# EAGLE design LEDdisplay (EAGLE 4.16)
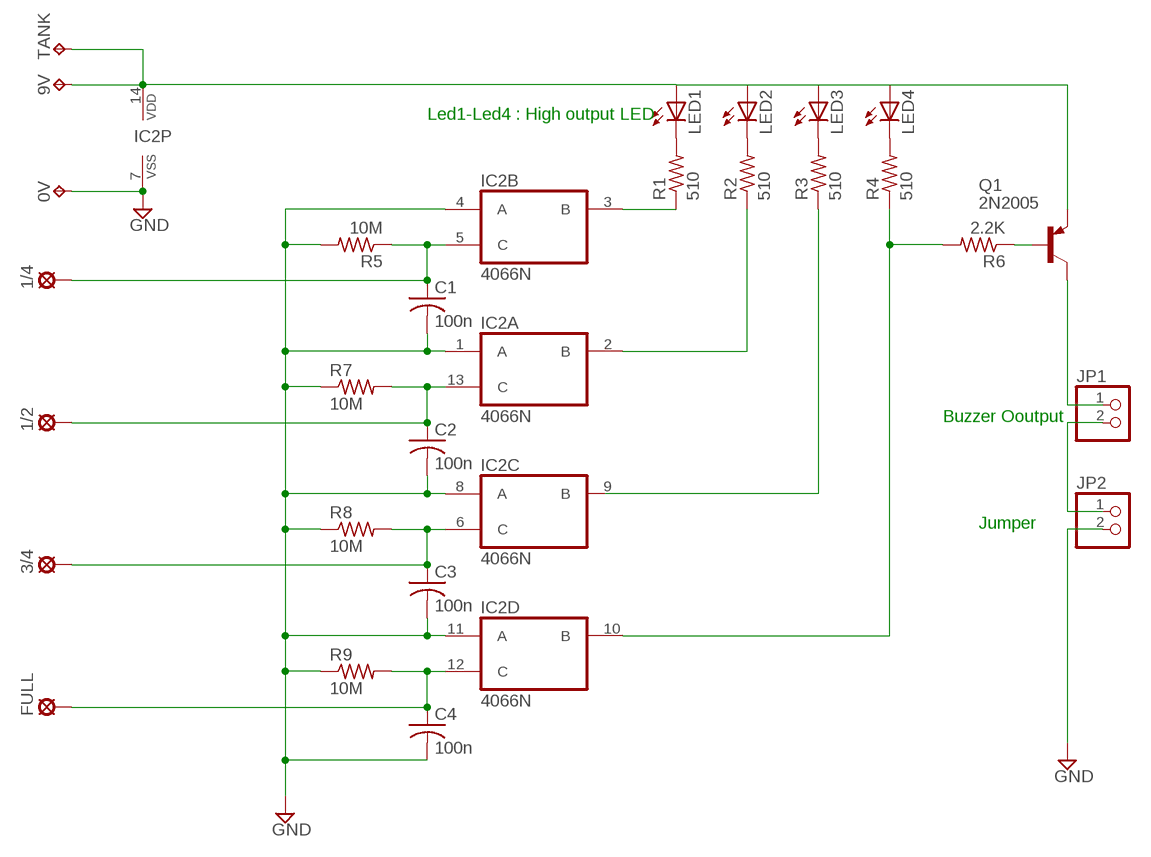
[diagram p0: schematic, sheet 1]

## Parts
0V  TPPAD1-13Y  [P1-13Y]
1/2  LSP10  [LSP10]
1/4  LSP10  [LSP10]
3/4  LSP10  [LSP10]
9V  TPPAD1-13Y  [P1-13Y]
C1  100n  C-US050-025X075  [C050-025X075]
C2  100n  C-US050-025X075  [C050-025X075]
C3  100n  C-US050-025X075  [C050-025X075]
C4  100n  C-US050-025X075  [C050-025X075]
FULL  LSP10  [LSP10]
IC2  4066N  [DIL14]
JP1  PINHD-1X2  [1X02]
JP2  PINHD-1X2  [1X02]
LED1  LED5MM  [LED5MM]
LED2  LED5MM  [LED5MM]
LED3  LED5MM  [LED5MM]
LED4  LED5MM  [LED5MM]
Q1  2N2005  BCX79  [TO92-EBC]
R1  510  R-US_0207/10  [0207/10]
R2  510  R-US_0207/10  [0207/10]
R3  510  R-US_0207/10  [0207/10]
R4  510  R-US_0207/10  [0207/10]
R5  10M  R-US_0207/10  [0207/10]
R6  2.2K  R-US_0207/10  [0207/10]
R7  10M  R-US_0207/10  [0207/10]
R8  10M  R-US_0207/10  [0207/10]
R9  10M  R-US_0207/10  [0207/10]
TANK  TPPAD1-13Y  [P1-13Y]

## Nets
GND: 0V.1(TP) C1.2 C2.2 C3.2 C4.2 IC2.1(A:A) IC2.4(B:A) IC2.7(P:VSS) IC2.8(C:A) IC2.11(D:A) JP2.2 R5.2 R7.1 R8.1 R9.1
N$1: LED1.K(C) R1.2
N$2: 1/4.MP C1.1 IC2.5(B:C) R5.1
N$3: 1/2.MP C2.1 IC2.13(A:C) R7.2
N$4: IC2.3(B:B) R1.1
N$5: LED2.K(C) R2.2
N$6: LED3.K(C) R3.2
N$7: LED4.K(C) R4.2
N$8: IC2.2(A:B) R2.1
N$9: IC2.9(C:B) R3.1
N$10: IC2.10(D:B) R4.1 R6.2
N$11: Q1.B R6.1
N$12: JP1.1 Q1.C
N$13: JP1.2 JP2.1
N$14: 3/4.MP C3.1 IC2.6(C:C) R8.2
N$15: C4.1 FULL.MP IC2.12(D:C) R9.2
N$16: 9V.1(TP) IC2.14(P:VDD) LED1.A LED2.A LED3.A LED4.A Q1.E TANK.1(TP)

## Notes on the sheet
- Led1-Led4 : High output LED
- Buzzer Ooutput
- Jumper

## Library data of the parts
0V 9V TANK = ZStofer:TP
1/2 1/4 3/4 FULL = solpad:LSP10: SOLDER PAD drill 1.0 mm, distributor Buerklin, 12H555
C1-C4 = rcl:C-US: CAPACITOR, American symbol
IC2 = 40xx:4066: Quad bilateral ANALOG SWITCH
JP1 JP2 = pinhead:PINHD-1X2: PIN HEADER
LED1-LED4 = led:LED: LED OSRAM: - CHIPLED LG R971, LG N971, LY N971, LG Q971, LY Q971, LO R971, LY R971 LH N974, LH R974 LS Q976, LO Q976, LY Q976 LO Q996 - Hyper CHIPLED LW Q18S LB Q993, LB Q99A, LB R99A - SideLED LS A670, LO A670, LY A670, LG A670, LP A670 LB A673, LV A673, LT A673, LW A673 LH A674 LY A675 LS A676, LA A676, LO A676, LY A676, LW A676 LS A679, LY A679, LG A679 - Hyper Micro SIDELED® LS Y876, LA Y876, LO Y876, LY Y876 LT Y87S - SmartLED LW L88C, LW L88S LB L89C, LB L89S, LG L890 LS L89K, LO L89K, LY L89K LS L896, LA L896, LO L896, LY L896 - TOPLED LS T670, LO T670, LY T670, LG T670, LP T670 LSG T670, LSP T670, LSY T670, LOP T670, LYG T670 LG T671, LOG T671, LSG T671 LB T673, LV T673, LT T673, LW T673 LH T674 LS T676, LA T676, LO T676, LY T676, LB T676, LH T676, LSB T676, LW T676 LB T67C, LV T67C, LT T67C, LS T67K, LO T67K, LY T67K, LW E67C LS E67B, LA E67B, LO E67B, LY E67B, LB E67C, LV E67C, LT E67C LW T67C LS T679, LY T679, LG T679 LS T770, LO T770, LY T770, LG T770, LP T770 LB T773, LV T773, LT T773, LW T773 LH T774 LS E675, LA E675, LY E675, LS T675 LS T776, LA T776, LO T776, LY T776, LB T776 LHGB T686 LT T68C, LB T68C - Hyper Mini TOPLED® LB M676 - Mini TOPLED Santana® LG M470 LS M47K, LO M47K, LY M47K Source: http://www.osram.convergy.de - LUMILED® LXK2-PW12-R00, LXK2-PW12-S00, LXK2-PW14-U00, LXK2-PW14-V00 LXK2-PM12-R00, LXK2-PM12-S00, LXK2-PM14-U00 LXK2-PE12-Q00, LXK2-PE12-R00, LXK2-PE12-S00, LXK2-PE14-T00, LXK2-PE14-U00 LXK2-PB12-K00, LXK2-PB12-L00, LXK2-PB12-M00, LXK2-PB14-N00, LXK2-PB14-P00, LXK2-PB14-Q00 LXK2-PR12-L00, LXK2-PR12-M00, LXK2-PR14-Q00, LXK2-PR14-R00 LXK2-PD12-Q00, LXK2-PD12-R00, LXK2-PD12-S00 LXK2-PH12-R00, LXK2-PH12-S00 LXK2-PL12-P00, LXK2-PL12-Q00, LXK2-PL12-R00 Source: www.luxeon.com
Q1 = transistor-pnp:BCX79*: PNP Transistror
R1-R9 = rcl:R-US_: RESISTOR, American symbol

## Board
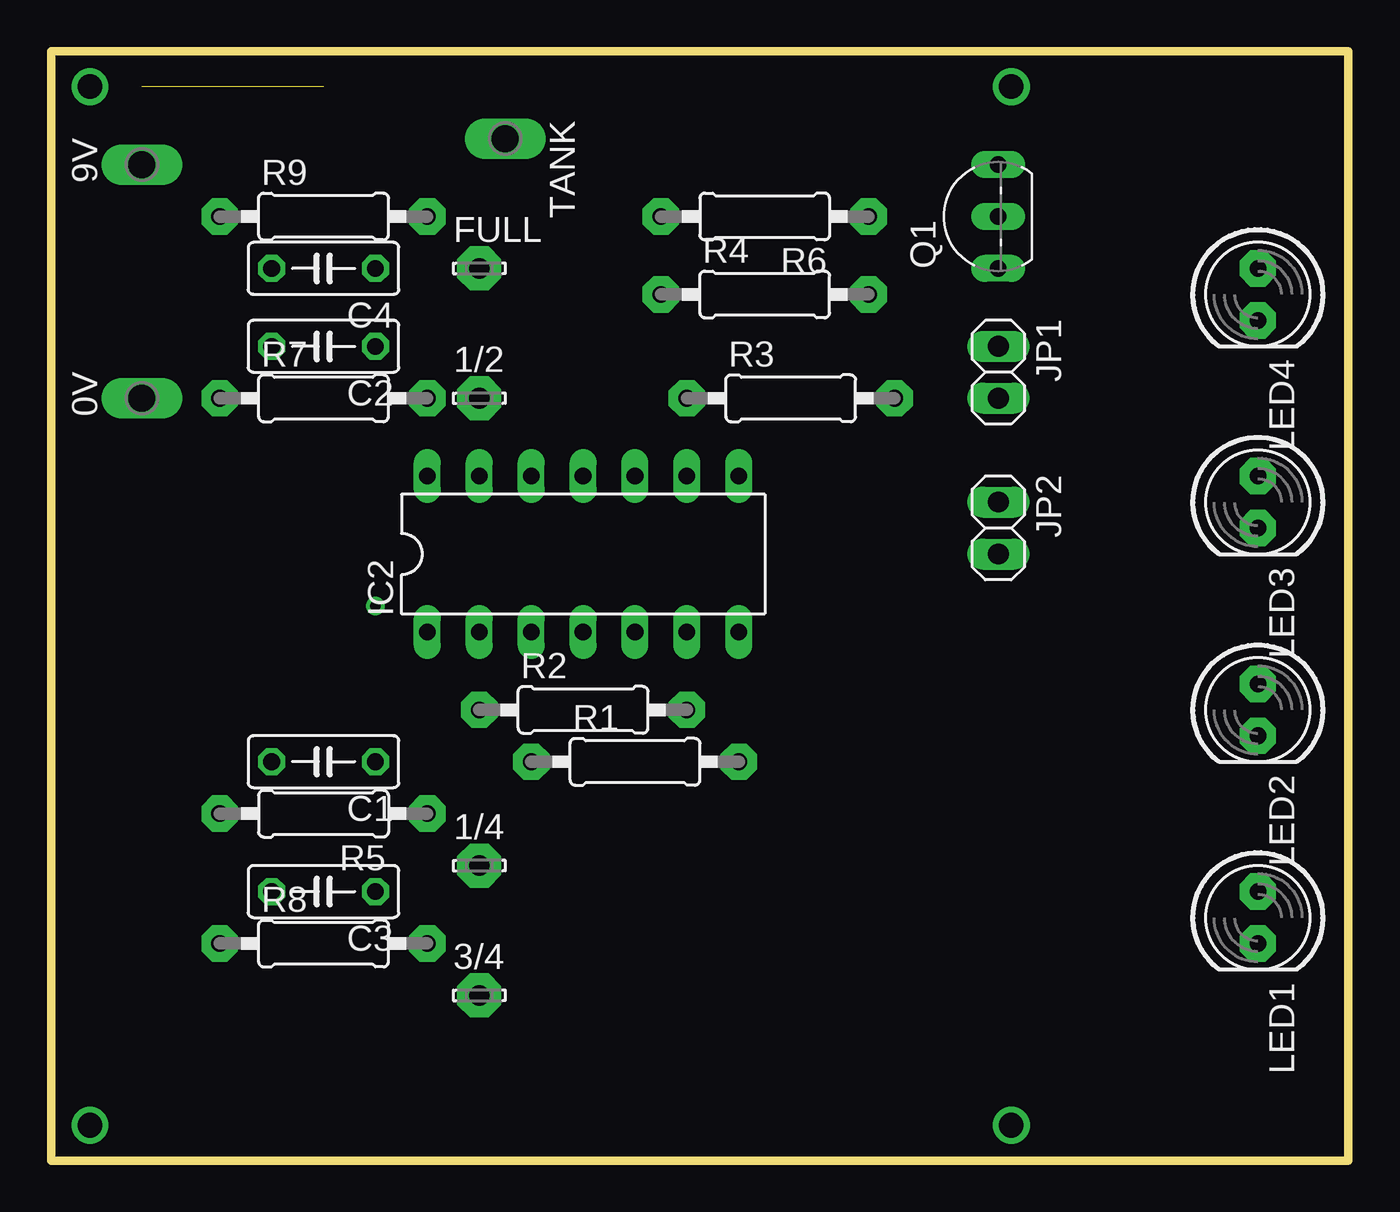
[diagram p1: board, top side]
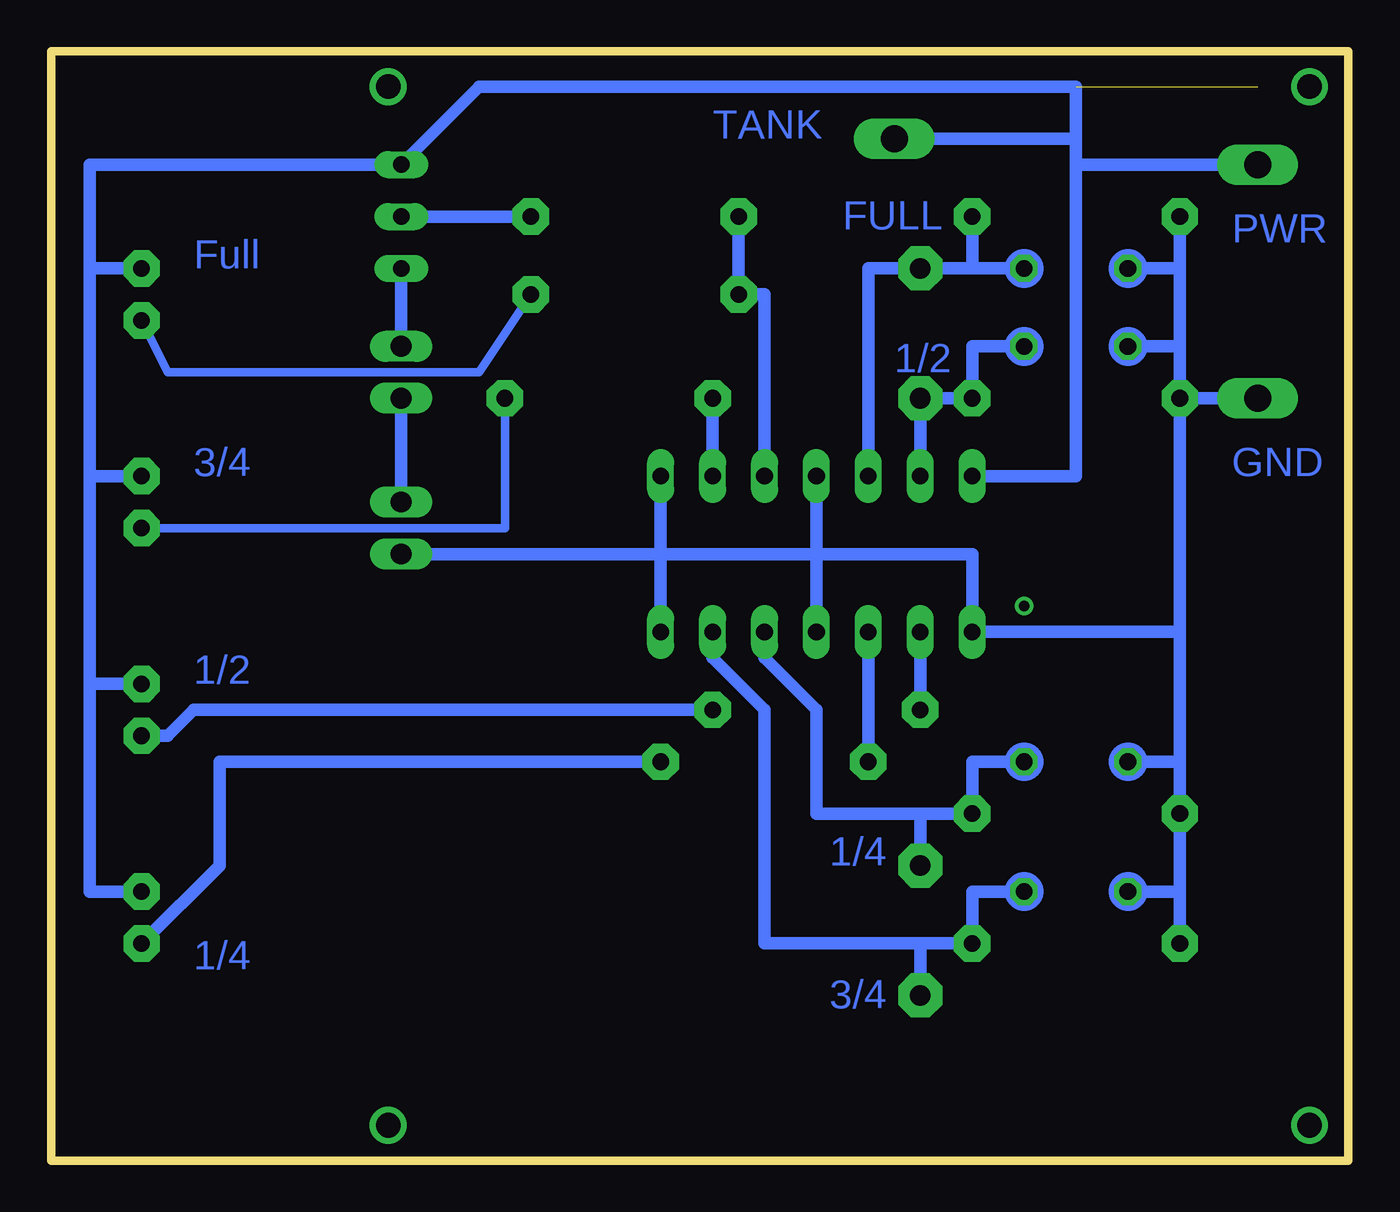
[diagram p2: board, bottom side, seen from below]

Size 63.48 x 54.28 mm. Coordinates in mm from the lower left corner, seen from the top.
Outline: 0,0 63.48,0 63.48,54.28 0,54.28 0,0
Copper layers (1*2+15*16): Top 0.035mm / dielectric 0.2mm / Route2 0.035mm / dielectric 0.15mm / Route15 0.035mm / dielectric 0.2mm / Bottom 0.035mm
Design rules "default": minimum track width 10mil, minimum drill 24mil, track to track 8mil, track to pad 8mil, pad to pad 8mil, via to via 8mil, smd to smd 8mil, copper to edge 40mil, drill to drill 8mil, minimum pad ring 10mil, minimum via ring 8mil, stop-mask expansion 4mil, vias tented up to drill 0mil, thermal gap 10mil

### Footprints (pad centres in the part's own frame; a part is rotated, then mirrored left to right if it is on the bottom)
P1-13Y = drill 1.321 pad 1.905 long: 1 0,0
LSP10 = drill 1.016 pad 2.159 octagon: MP 0,0
C050-025X075 = drill 0.813 octagon: 1 -2.54,0; 2 2.54,0
DIL14 = drill 0.813 long: 1 -7.62,-3.81; 2 -5.08,-3.81; 3 -2.54,-3.81; 4 0,-3.81; 5 2.54,-3.81; 6 5.08,-3.81; 7 7.62,-3.81; 8 7.62,3.81; 9 5.08,3.81; 10 2.54,3.81; 11 0,3.81; 12 -2.54,3.81; 13 -5.08,3.81; 14 -7.62,3.81
1X02 = drill 1.016 long: 1 -1.27,0; 2 1.27,0
LED5MM = drill 0.813 pad 1.778 octagon: A -1.27,0; K 1.27,0
TO92-EBC = drill 0.813 long: B 0,-1.27; C -2.54,-1.27; E 2.54,-1.27
0207/10 = drill 0.813 pad 1.778 octagon: 1 -5.08,0; 2 5.08,0

### Placement (x,y rotation side)
0V  4.44,37.3 90 top
1/2  20.95,37.3 0 top
1/4  20.95,14.44 0 top
3/4  20.95,8.09 0 top
9V  4.44,48.73 90 top
C1  13.33,19.52 180 top
C2  13.33,39.84 180 top
C3  13.33,13.17 180 top
C4  13.33,43.65 180 top
FULL  20.95,43.65 0 top
IC2  26.03,29.68 0 top
JP1  46.35,38.57 270 top
JP2  46.35,30.95 270 top
LED1  59.05,11.9 270 top
LED2  59.05,22.06 270 top
LED3  59.05,32.22 270 top
LED4  59.05,42.38 270 top
Q1  45.08,46.19 90 top
R1  28.57,19.52 0 top
R2  26.03,22.06 0 top
R3  36.19,37.3 0 top
R4  34.92,42.38 0 top
R5  13.33,16.98 180 top
R6  34.92,46.19 180 top
R7  13.33,37.3 0 top
R8  13.33,10.63 0 top
R9  13.33,46.19 0 top
TANK  22.22,50 270 top

### Tracks (layer width: path | path; a pad name or v marks a point on that pad's centre or on a via)
GND
  Bottom 0.406: 14.6,25.87 15.87,25.87
  Bottom 0.61: 26.03,29.68 IC2.11 | 26.03,29.68 33.65,29.68 | 33.65,29.68 IC2.8 | 26.03,29.68 18.41,29.68 IC2.1 14.6,25.87 8.25,25.87 | 26.03,29.68 IC2.4 | 8.25,25.87 R7.1 | R8.1 8.25,13.17 | 8.25,13.17 R5.2 8.25,19.52 | 33.65,29.68 IC2.7 | 33.65,29.68 JP2.2 | R7.1 0V.1 | R7.1 8.25,39.84 | 8.25,39.84 8.25,43.65 | 8.25,43.65 R9.1 | 8.25,19.52 8.25,25.87 | 8.25,39.84 C2.2 | 8.25,43.65 C4.2 | 8.25,19.52 C1.2 | 8.25,13.17 C3.2
N$1
  Bottom 0.61: R1.2 55.24,19.52 55.24,14.44 LED1.K
N$2
  Bottom 0.61: IC2.5 28.57,24.6 26.03,22.06 26.03,16.98 20.95,16.98 | C1.1 18.41,19.52 R5.1 20.95,16.98 | 1/4.MP 20.95,16.98
N$3
  Bottom 0.61: C2.1 18.41,39.84 R7.2 1/2.MP IC2.13
N$4
  Bottom 0.61: R1.1 IC2.3
N$5
  Bottom 0.61: R2.2 56.51,22.06 57.78,20.79 LED2.K
N$6
  Bottom 0.406: R3.2 41.27,30.95 LED3.K
N$7
  Bottom 0.406: R4.2 42.54,38.57 57.78,38.57 LED4.K
N$8
  Bottom 0.61: R2.1 IC2.2
N$9
  Bottom 0.61: IC2.9 R3.1
N$10
  Bottom 0.61: IC2.10 28.57,42.38 R4.1 R6.2
N$11
  Bottom 0.61: R6.1 Q1.B
N$12
  Bottom 0.61: JP1.1 Q1.C
N$13
  Bottom 0.61: JP2.1 JP1.2
N$14
  Bottom 0.61: IC2.6 31.11,24.6 28.57,22.06 28.57,10.63 20.95,10.63 | C3.1 18.41,13.17 R8.2 20.95,10.63 | 3/4.MP 20.95,10.63
N$15
  Bottom 0.61: C4.1 18.41,43.65 | 18.41,43.65 R9.2 | 18.41,43.65 FULL.MP 23.49,43.65 IC2.12
N$16  (1 unrouted)
  Bottom 0.61: IC2.14 13.33,33.49 13.33,48.73 | 13.33,48.73 13.33,50 | 13.33,50 13.33,52.54 42.54,52.54 Q1.E 61.59,48.73 61.59,43.65 | 61.59,43.65 61.59,33.49 | 61.59,33.49 LED3.A | 61.59,33.49 61.59,23.33 | 61.59,23.33 LED2.A | 61.59,23.33 61.59,13.17 LED1.A | 61.59,43.65 LED4.A | 13.33,50 TANK.1 | 13.33,48.73 9V.1
N$17  (via drill 1.2)
  other vias: 46.98,1.74
N$18  (via drill 1.2)
  other vias: 46.98,52.54
N$19  (via drill 1.2)
  other vias: 1.9,1.74
N$20  (via drill 1.2)
  other vias: 1.9,52.54
N$21  (via drill 0.5)
  other vias: 15.87,27.14
(copper drawn outside any net)
  shapes: Bottom circle x8

### Text on the board
Bottom: TANK | FULL | PWR | Full | 1/2 | GND | 3/4 | 1/2 | 1/4 | 1/4 | 3/4